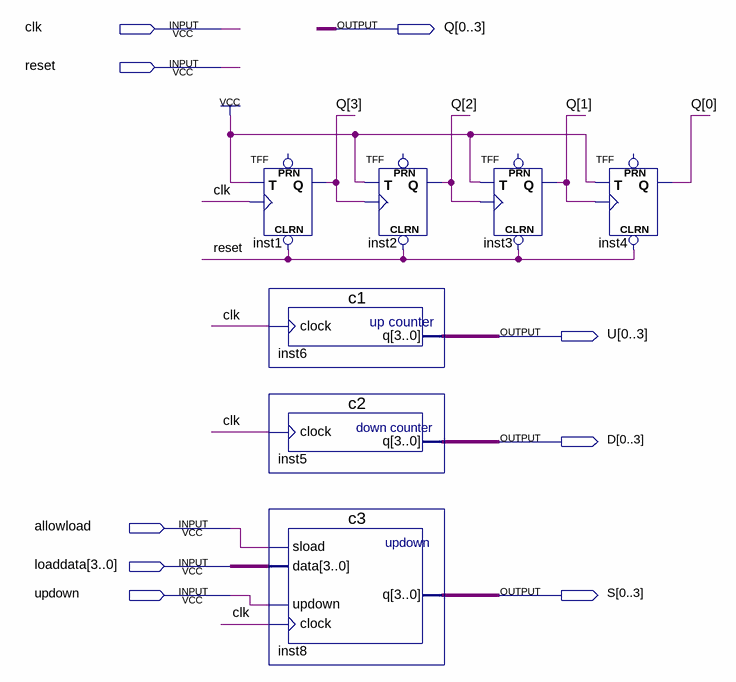
[diagram p0: schematic sheet]
// Quartus schematic p1.bdf as structural Verilog: 7 symbols, 9 pins
module p1 (
  input  clk,
  input  reset,
  input  allowload,
  input  [3:0] loaddata,
  input  updown,
  output [0:3] Q,
  output [0:3] U,
  output [0:3] D,
  output [0:3] S
);

  TFF inst1 (.CLRN(reset), .T(1'b1), .CLK(clk), .Q(Q[3]));  // open: PRN
  c1 inst6 (.clock(clk), .q(U));
  c2 inst5 (.clock(clk), .q(D));
  c3 inst8 (.sload(allowload), .data(loaddata), .updown(updown), .clock(clk), .q(S));
  TFF inst2 (.CLRN(reset), .T(1'b1), .CLK(Q[3]), .Q(Q[2]));  // open: PRN
  TFF inst3 (.CLRN(reset), .T(1'b1), .CLK(Q[2]), .Q(Q[1]));  // open: PRN
  TFF inst4 (.CLRN(reset), .T(1'b1), .CLK(Q[1]), .Q(Q[0]));  // open: PRN
endmodule
